# Altium schematic sheet remote control.SchDoc
size A3
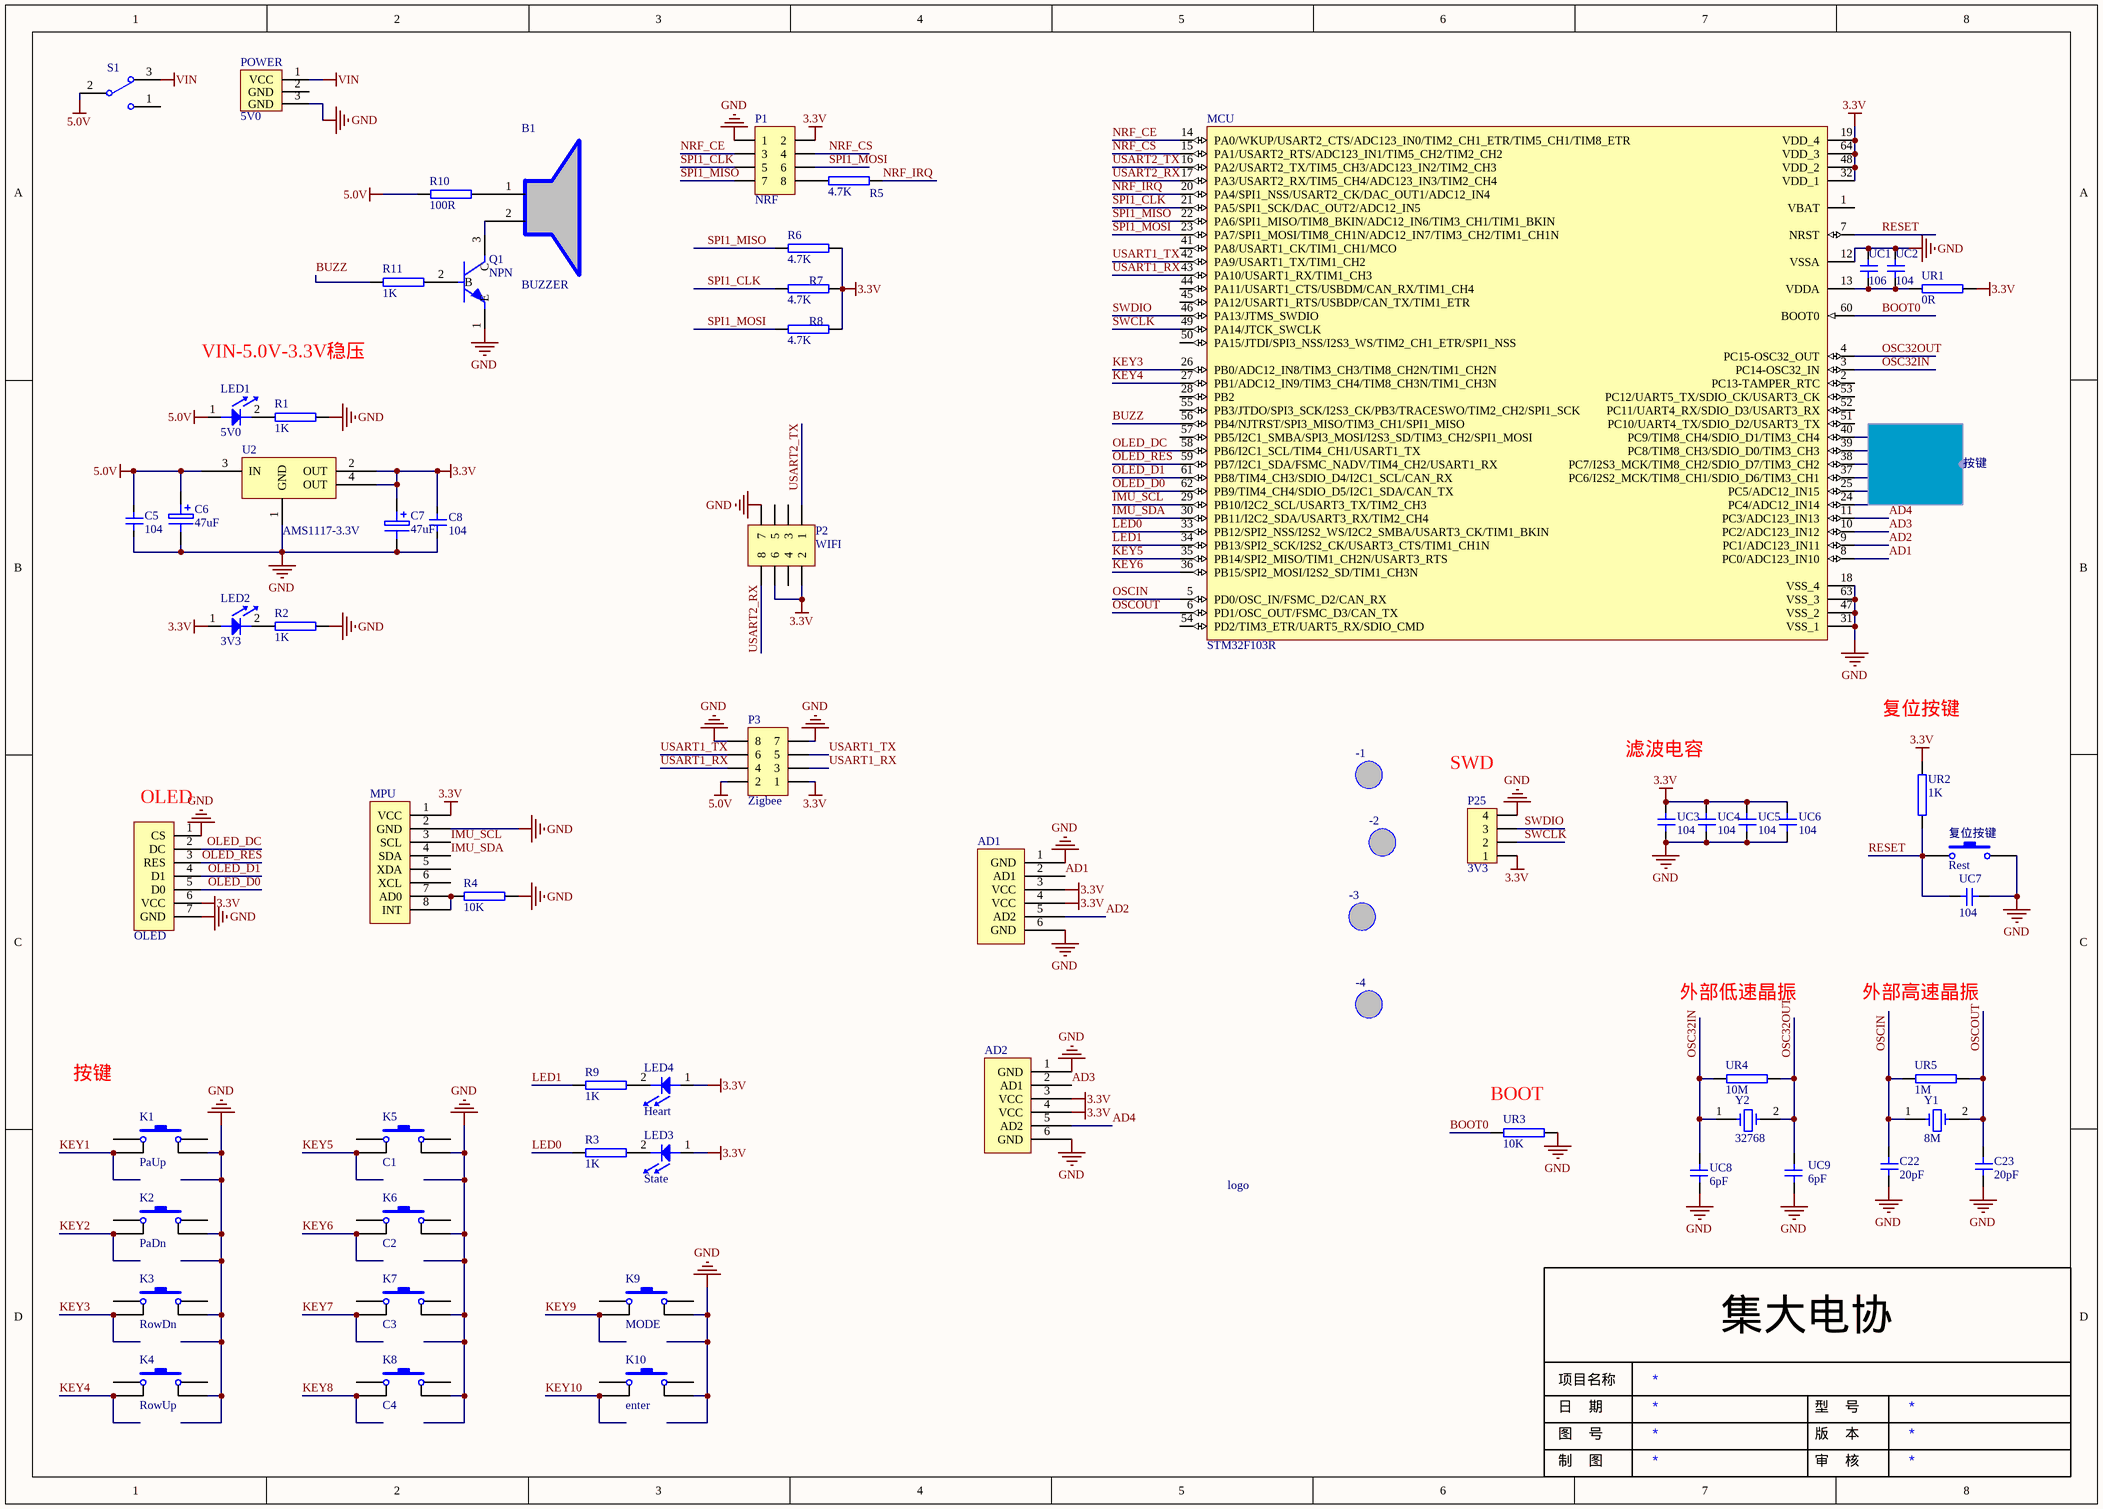
[diagram p0: remote control.SchDoc]

## Parts
-1  (no value)  [定位孔]
-2  (no value)  [定位孔]
-3  (no value)  [定位孔]
-4  (no value)  [定位孔]
?  OLED  [OLED]
AD1  (no value)  [无人机遥感]
AD2  (no value)  [无人机遥感]
B1  BUZZER  [蜂鸣器(有源)]
C5  104  [0805C]
C6  47uF  [Cap1(47uF)]
C7  47uF  [Cap1(47uF)]
C8  104  [0805C]
C22  20pF  [0805C]
C23  20pF  [0805C]
K1  PaUp  [SW_PB4_DIP]
K2  PaDn  [SW_PB4_DIP]
K3  RowDn  [SW_PB4_DIP]
K4  RowUp  [SW_PB4_DIP]
K5  C1  [SW_PB4_DIP]
K6  C2  [SW_PB4_DIP]
K7  C3  [SW_PB4_DIP]
K8  C4  [SW_PB4_DIP]
K9  MODE  [SW_PB4_DIP]
K10  enter  [SW_PB4_DIP]
LED1  5V0  [0805LED]
LED2  3V3  [0805LED]
LED3  State  [0805LED]
LED4  Heart  [0805LED]
logo  (no value)  [集大电协]
MCU  STM32F103R  [LQFP-64N]
MPU  (no value)  [MPU6050]
P1  NRF  [Header 4X2]
P2  WIFI  [Header 4X2]
P3  Zigbee  [Header 4X2]
P25  3V3  [Header 4]
POWER  5V0  [DC-005]
Q1  NPN  [NPN]
R1  1K  [0805R]
R2  1K  [0805R]
R3  1K  [0805R]
R4  10K  [0805R]
R5  4.7K  [0805R]
R6  4.7K  [0805R]
R7  4.7K  [0805R]
R8  4.7K  [0805R]
R9  1K  [0805R]
R10  100R  [0805R]
R11  1K  [0805R]
S1  (no value)  [拨动开关（倒针）]
U2  AMS1117-3.3V  [SOT-223]
UC1  106  [0805C]
UC2  104  [0805C]
UC3  104  [0805C]
UC4  104  [0805C]
UC5  104  [0805C]
UC6  104  [0805C]
UC7  104  [0805C]
UC8  6pF  [0805C]
UC9  6pF  [0805C]
UR1  0R  [0805R]
UR2  1K  [0805R]
UR3  10K  [0805R]
UR4  10M  [0805R]
UR5  1M  [0805R]
Y1  8M  [22M(晶振)]
Y2  32768  [XTAL]
复位按键  Rest  [贴片按键]

## Harnesses
按键: 

## Nets
3.3V: ?.6(VCC) AD1.3(VCC) AD1.4(VCC) AD2.3(VCC) AD2.4(VCC) C7.1 C8.2 LED2.1 LED3.1 LED4.1 MCU.19(VDD_4) MCU.32(VDD_1) MCU.48(VDD_2) MCU.64(VDD_3) MPU.1(VCC) P1.2 P2.2 P2.6 P3.1 P25.1 R6.2 R7.2 R8.2 U2.2(OUT) U2.4(OUT) UC3.2 UC4.2 UC5.2 UC6.2 UR1.2 UR2.2
5.0V: C5.2 C6.1 LED1.1 P3.2 R10.2 S1.2 U2.3(IN)
GND: ?.1(CS) ?.7(GND) AD1.1(GND) AD1.6(GND) AD2.1(GND) AD2.6(GND) C5.1 C6.2 C7.2 C8.1 C22.1 C23.1 K1.3 K2.3 K3.3 K4.3 K5.3 K6.3 K7.3 K8.3 K9.3 K10.3 MCU.12(VSSA) MCU.18(VSS_4) MCU.31(VSS_1) MCU.47(VSS_2) MCU.63(VSS_3) MPU.2(GND) P1.1 P2.7 P3.7 P3.8 P25.4 POWER.3(GND) Q1.1(E) R1.1 R2.1 R4.1 U2.1(GND) UC1.2 UC2.2 UC3.1 UC4.1 UC5.1 UC6.1 UC7.2 UC8.2 UC9.2 UR3.2 复位按键.2
VIN: POWER.1(VCC) S1.3
AD1: AD1.2(AD1) MCU.8(PC0/ADC123_IN10)
AD2: AD1.5(AD2) MCU.9(PC1/ADC123_IN11)
AD3: AD2.2(AD1) MCU.10(PC2/ADC123_IN12)
AD4: AD2.5(AD2) MCU.11(PC3/ADC123_IN13)
BOOT0: MCU.60(BOOT0) UR3.1
BUZZ: MCU.56(PB4/NJTRST/SPI3_MISO/TIM3_CH1/SPI1_MISO) R11.2
IMU_SCL: MCU.29(PB10/I2C2_SCL/USART3_TX/TIM2_CH3) MPU.3(SCL)
IMU_SDA: MCU.30(PB11/I2C2_SDA/USART3_RX/TIM2_CH4) MPU.4(SDA)
KEY1: K1.4 MCU.24(PC4/ADC12_IN14)
KEY2: K2.4 MCU.25(PC5/ADC12_IN15)
KEY3: K3.4 MCU.26(PB0/ADC12_IN8/TIM3_CH3/TIM8_CH2N/TIM1_CH2N)
KEY4: K4.4 MCU.27(PB1/ADC12_IN9/TIM3_CH4/TIM8_CH3N/TIM1_CH3N)
KEY5: K5.4 MCU.35(PB14/SPI2_MISO/TIM1_CH2N/USART3_RTS)
KEY6: K6.4 MCU.36(PB15/SPI2_MOSI/I2S2_SD/TIM1_CH3N)
KEY7: K7.4 MCU.37(PC6/I2S2_MCK/TIM8_CH1/SDIO_D6/TIM3_CH1)
KEY8: K8.4 MCU.38(PC7/I2S3_MCK/TIM8_CH2/SDIO_D7/TIM3_CH2)
KEY9: K9.4 MCU.39(PC8/TIM8_CH3/SDIO_D0/TIM3_CH3)
KEY10: K10.4 MCU.40(PC9/TIM8_CH4/SDIO_D1/TIM3_CH4)
LED0: MCU.33(PB12/SPI2_NSS/I2S2_WS/I2C2_SMBA/USART3_CK/TIM1_BKIN) R3.2
LED1: MCU.34(PB13/SPI2_SCK/I2S2_CK/USART3_CTS/TIM1_CH1N) R9.2
NRF_CE: MCU.14(PA0/WKUP/USART2_CTS/ADC123_IN0/TIM2_CH1_ETR/TIM5_CH1/TIM8_ETR) P1.3
NRF_CS: MCU.15(PA1/USART2_RTS/ADC123_IN1/TIM5_CH2/TIM2_CH2) P1.4
NRF_IRQ: MCU.20(PA4/SPI1_NSS/USART2_CK/DAC_OUT1/ADC12_IN4) R5.1
OLED_D0: ?.5(D0) MCU.62(PB9/TIM4_CH4/SDIO_D5/I2C1_SDA/CAN_TX)
OLED_D1: ?.4(D1) MCU.61(PB8/TIM4_CH3/SDIO_D4/I2C1_SCL/CAN_RX)
OLED_DC: ?.2(DC) MCU.58(PB6/I2C1_SCL/TIM4_CH1/USART1_TX)
OLED_RES: ?.3(RES) MCU.59(PB7/I2C1_SDA/FSMC_NADV/TIM4_CH2/USART1_RX)
OSC32IN: MCU.3(PC14-OSC32_IN) UC8.1 UR4.1 Y2.1
OSC32OUT: MCU.4(PC15-OSC32_OUT) UC9.1 UR4.2 Y2.2
OSCIN: C22.2 MCU.5(PD0/OSC_IN/FSMC_D2/CAN_RX) UR5.1 Y1.1
OSCOUT: C23.2 MCU.6(PD1/OSC_OUT/FSMC_D3/CAN_TX) UR5.2 Y1.2
RESET: MCU.7(NRST) UC7.1 UR2.1 复位按键.1
SPI1_CLK: MCU.21(PA5/SPI1_SCK/DAC_OUT2/ADC12_IN5) P1.5 R7.1
SPI1_MISO: MCU.22(PA6/SPI1_MISO/TIM8_BKIN/ADC12_IN6/TIM3_CH1/TIM1_BKIN) P1.7 R6.1
SPI1_MOSI: MCU.23(PA7/SPI1_MOSI/TIM8_CH1N/ADC12_IN7/TIM3_CH2/TIM1_CH1N) P1.6 R8.1
SWCLK: MCU.49(PA14/JTCK_SWCLK) P25.2
SWDIO: MCU.46(PA13/JTMS_SWDIO) P25.3
USART1_RX: MCU.43(PA10/USART1_RX/TIM1_CH3) P3.3 P3.4
USART1_TX: MCU.42(PA9/USART1_TX/TIM1_CH2) P3.5 P3.6
USART2_RX: MCU.17(PA3/USART2_RX/TIM5_CH4/ADC123_IN3/TIM2_CH4) P2.8
USART2_TX: MCU.16(PA2/USART2_TX/TIM5_CH3/ADC123_IN2/TIM2_CH3) P2.1
NetB1_1: B1.1 R10.1
NetB1_2: B1.2 Q1.3(C)
NetLED1_2: LED1.2 R1.2
NetLED2_2: LED2.2 R2.2
NetLED3_2: LED3.2 R3.1
NetLED4_2: LED4.2 R9.1
NetMCU_13: MCU.13(VDDA) UC1.1 UC2.1 UR1.1
NetMPU_7: MPU.7(AD0) MPU.8(INT) R4.2
NetP1_8: P1.8 R5.2
NetQ1_2: Q1.2(B) R11.1

Not connected (* = marked no-connect by the designer): K1 1 2; K2 1 2; K3 1 2; K4 1 2; K5 1 2; K6 1 2; K7 1 2; K8 1 2; K9 1 2; K10 1 2; MCU 1(VBAT) 2(PC13-TAMPER_RTC) 28(PB2) 41(PA8/USART1_CK/TIM1_CH1/MCO) 44(PA11/USART1_CTS/USBDM/CAN_RX/TIM1_CH4) 45(PA12/USART1_RTS/USBDP/CAN_TX/TIM1_ETR) 50(PA15/JTDI/SPI3_NSS/I2S3_WS/TIM2_CH1_ETR/SPI1_NSS) 51(PC10/UART4_TX/SDIO_D2/USART3_TX) 52(PC11/UART4_RX/SDIO_D3/USART3_RX) 53(PC12/UART5_TX/SDIO_CK/USART3_CK) 54(PD2/TIM3_ETR/UART5_RX/SDIO_CMD) 55(PB3/JTDO/SPI3_SCK/I2S3_CK/PB3/TRACESWO/TIM2_CH2/SPI1_SCK) 57(PB5/I2C1_SMBA/SPI3_MOSI/I2S3_SD/TIM3_CH2/SPI1_MOSI); MPU 5(XDA) 6(XCL); P2 3 4 5; POWER 2(GND); S1 1

## Notes on the sheet
- VIN-5.0V-3.3V稳压
- 复位按键
- (near P25) SWD
- 滤波电容
- OLED
- 外部低速晶振
- 外部高速晶振
- 按键
- (near UR3) BOOT
- 集大电协
- 项目名称
- 日    期
- 图    号
- 版    本
- 型    号
- 制    图
- 审    核

## Library data of the parts
-1--4 = 定位孔
AD1 AD2 = 无人机摇杆
C5 C8 C22 C23 UC1-UC9 = C1
C6 C7 = Cap1(100uF)
K1-K10 = Key(四脚)
LED1-LED4 = LED
logo = 集大电协
MPU = MPU6050
P1-P3 = Header 4X2
P25 = Header 4
POWER = DC-005
Q1 = Q2
R1-R11 UR1-UR5 = R1
S1 = 钮子开关
U2 = AMS1117-3.3V/5.0V
Y1 Y2 = XTAL
复位按键 = Key(两脚贴片)